# Altium project UCC28180 PFC-V02-GOWANDA.PrjPcb (part 2 of 2)

## Sheet UCC28180-2-V02 - GOWANDA.SchDoc: Title is Here
size B; Author: Taisen Zhuang; Organization: Altium Limited; Address1: L3, 12a Rodborough Rd; Address2: Frenchs Forest; Address3: NSW; Address4: Australia 2086; DocumentNumber: FMC_Microzed; Revision: B; SheetNumber: 1; SheetTotal: 3
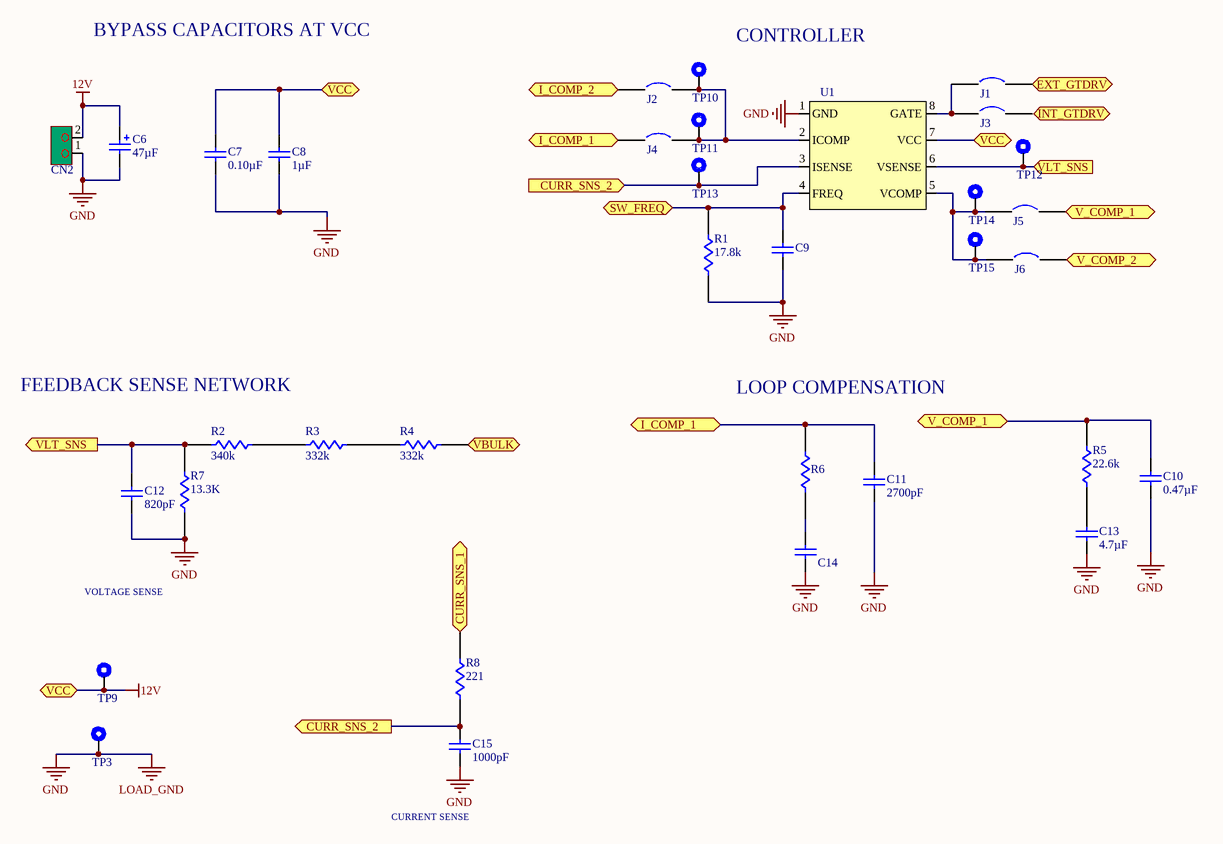
[diagram p2: UCC28180-2-V02 - GOWANDA.SchDoc]

### Parts
C6  Capacitance: 47µF  [CAPALUM47U]  (hidden comment: ECA-1VM470)
C7  Capacitance: 0.10µF  [CAP0603]  (hidden comment: 06035C104KAT2A)
C8  Capacitance: 1µF  [CAP1206]  (hidden comment: GRM32RR71H105KA01K)
C9  (no value)  [CAP0603]
C10  Capacitance: 0.47µF  [CAP0603]  (hidden comment: C0603C474K4RACTU)
C11  Capacitance: 2700pF  [CAP0603]  (hidden comment: GRM188R71H272KA01D)
C12  Capacitance: 820pF  [CAP0603]  (hidden comment: C0603C821K5RACTU)
C13  Capacitance: 4.7µF  [CAP0805]  (hidden comment: GRM21BR71A475KA73L)
C14  C0603--  [CAP0603]  (value not drawn)
C15  Capacitance: 1000pF  [CAP0603]  (hidden comment: 06031C102KAT2A)
CN2  1935776  [CONN_1935776]  (value not drawn)
J1  M20-9990246  [JUMPER]  (value not drawn)
J2  M20-9990246  [RES0603]  (value not drawn)
J3  M20-9990246  [JUMPER]  (value not drawn)
J4  M20-9990246  [RES0603]  (value not drawn)
J5  M20-9990246  [0603R]  (value not drawn)
J6  M20-9990246  [JUMPER]  (value not drawn)
R1  Resistance (Ohms): 17.8k  [RES0603]  (hidden comment: CRCW060317K8FKEA)
R2  Resistance (Ohms): 340k  [RES0805]  (hidden comment: CRCW0805340KFKEA)
R3  Resistance (Ohms): 332k  [RES0805]  (hidden comment: CRCW0805332KFKEA)
R4  Resistance (Ohms): 332k  [RES0805]  (hidden comment: CRCW0805332KFKEA)
R5  Resistance (Ohms): 22.6k  [CAP0603]  (hidden comment: CRCW060322K6FKEA)
R6  CRCW0603--  [RES0603]  (value not drawn)
R7  Resistance: 13.3K  [RES0603]  (hidden comment: CRCW060313K3FKEA)
R8  Resistance (Ohms): 221  [RES0805]  (hidden comment: CRCW0603221RFKEA)
TP3  5006  [Test Point]  (value not drawn)
TP9  5006  [Test Point]  (value not drawn)
TP10  5006  [Test Point]  (value not drawn)
TP11  5006  [Test Point]  (value not drawn)
TP12  5006  [Test Point]  (value not drawn)
TP13  5006  [Test Point]  (value not drawn)
TP14  5006  [Test Point]  (value not drawn)
TP15  5006  [Test Point]  (value not drawn)
U1  UCC28180DR  [SOP127P600X175-8N]  (value not drawn)

### Ports
CURR_SNS_1 (in), CURR_SNS_2 (in), CURR_SNS_2 (out), EXT_GTDRV (out), I_COMP_1 (bidir), I_COMP_2 (bidir), INT_GTDRV (out), SW_FREQ (bidir), V_COMP_1 (bidir), V_COMP_2 (bidir), VBULK (in), VCC (bidir), VLT_SNS (in), VLT_SNS (out)

### Nets
12V: C6.1 C7.1 C8.2 CN2.2 TP9.1 U1.7(VCC) ; port VCC
GND: C6.2 C7.2 C8.1 C9.1 C10.1 C11.1 C12.1 C13.1 C14.1 C15.1 CN2.1 R1.2 R7.2 TP3.1 U1.1(GND)  [also labelled LOAD_GND]
NetBR1_4: R8.1 ; port CURR_SNS_1
NetC9_2: C9.2 R1.1 U1.4(FREQ) ; port SW_FREQ
NetC10_2: C10.2 J5.2 R5.1 ; port V_COMP_1
NetC11_2: C11.2 J4.1 R6.1 ; port I_COMP_1
NetC12_2: C12.2 R2.2 R7.1 TP12.1 U1.6(VSENSE) ; port VLT_SNS
NetC13_2: C13.2 R5.2
NetC14_2: C14.2 R6.2
NetC15_2: C15.2 R8.2 TP13.1 U1.3(ISENSE) ; port CURR_SNS_2
NetJ1_1: J1.1 J3.1 U1.8(GATE)
NetJ1_2: J1.2 ; port EXT_GTDRV
NetJ2_1: J2.1 ; port I_COMP_2
NetJ2_2: J2.2 J4.2 TP10.1 TP11.1 U1.2(ICOMP)
NetJ5_1: J5.1 J6.1 TP14.1 TP15.1 U1.5(VCOMP)
NetJ6_2: J6.2 ; port V_COMP_2
NetR2_1: R2.1 R3.2
NetR3_1: R3.1 R4.2
NetR4_1: R4.1 ; port VBULK

Not connected (* = marked no-connect by the designer): J3 2

### Notes on the sheet
- BYPASS CAPACITORS AT VCC
- CONTROLLER
- FEEDBACK SENSE NETWORK
- LOOP COMPENSATION
- VOLTAGE SENSE
- CURRENT SENSE
- PMLS Engineers R&D
- Title:
- Size:
- Date:
- B
- Document Number:
- Sheet:
- of
- Author:
- Rev:

### Library data of the parts
C6 = ECA-1VM470: CAP ALUM 47UF 20% 35V RADIAL; Manufacturer 1: Panasonic Electronic Components; Category 1: Capacitors; Lifetime @ Temp.: 2000 Hrs @ 85°C; Polarization: Polar; Ripple Current: 130mA @ 120Hz; Supplier 1: Digi-Key; Supplier Part Number 1: P5164-ND; Manufacturer Part Number 1: ECA-1VM470; RoHS 1: RoHS Compliant; Description 1: CAP ALUM 47UF 20% 35V RADIAL; Stock 1: 32051; Pricing 1: 1=0.19, 10=0.131, 25=0.0964, 50=0.0788, 100=0.0665, 250=0.05424, 500=0.0455, 1000=0.04025, 5000=0.035 (USD); Packaging: Bulk; Part Status: Active; Tolerance: ±20%; Voltage Rating: 35V; ESR (Equivalent Series Resistance): -; Operating Temperature: -40°C ~ 85°C; Applications: General Purpose; Impedance: -; Lead Spacing: 0.079" (2.00mm); Size / Dimension: 0.197" Dia (5.00mm); Height - Seated (Max): 0.472" (12.00mm); Surface Mount Land Size: -; Mounting Type: Through Hole; Package / Case: Radial, Can; ComponentLink1URL: http://industrial.panasonic.com/www-cgi/jvcr13pz.cgi?E+PZ+3+ABA0012+ECA1VM470+7+WW; ComponentLink1Description: http://industrial.panasonic.com/www-cgi/jvcr13pz.cgi?E+PZ+3+ABA0012+ECA1VM470+7+WW
C7 = 06035C104KAT2A: CAP CER 0.1UF 50V X7R 0603; Manufacturer 1: AVX Corporation; Category 1: Capacitors; Tolerance: ±10%; Supplier 1: Digi-Key; Supplier Part Number 1: 478-5052-6-ND; Manufacturer Part Number 1: 06035C104KAT2A; RoHS 1: RoHS Compliant; Description 1: CAP CER 0.1UF 50V X7R 0603; Stock 1: 1164910; Pricing 1: 1=0.1, 10=0.037, 25=0.0268, 50=0.0202, 100=0.0165, 250=0.01376, 500=0.01176, 1000=0.00924 (USD); Packaging: Digi-Reel®; Part Status: Active; Voltage - Rated: 50V; Temperature Coefficient: X7R; Operating Temperature: -55°C ~ 125°C; Features: -; Ratings: -; Applications: General Purpose; Mounting Type: Surface Mount, MLCC; Package / Case: 0603 (1608 Metric); Size / Dimension: 0.063" L x 0.032" W (1.60mm x 0.81mm); Height - Seated (Max): -; Thickness (Max): 0.035" (0.90mm); Lead Spacing: -; Lead Style: -; ComponentLink1URL: http://datasheets.avx.com/X7RDielectric.pdf; ComponentLink1Description: http://datasheets.avx.com/X7RDielectric.pdf
C8 = GRM32RR71H105KA01K: CAP CER 1UF 50V X7R 1210; Manufacturer 1: Murata Electronics North America; Category 1: Capacitors; Tolerance: ±10%; Description 2: CAP CER 0.1UF 50V X7R 1206; Supplier 1: Digi-Key; Supplier Part Number 1: 490-11661-1-ND; Manufacturer Part Number 1: GRM32RR71H105KA01K; RoHS 1: RoHS Compliant; Description 1: CAP CER 1UF 50V X7R 1210; Stock 1: 3574; Pricing 1: 1=0.32, 10=0.28, 50=0.17, 100=0.14, 250=0.112, 500=0.102, 1000=0.092 (USD); Packaging: Cut Tape (CT); Part Status: Active; Voltage - Rated: 50V; Temperature Coefficient: X7R; Operating Temperature: -55°C ~ 125°C; Features: -; Ratings: -; Applications: General Purpose; Mounting Type: Surface Mount, MLCC; Package / Case: 1210 (3225 Metric); Size / Dimension: 0.126" L x 0.098" W (3.20mm x 2.50mm); Height - Seated (Max): -; Thickness (Max): 0.079" (2.00mm); Lead Spacing: -; Lead Style: -; ComponentLink1URL: http://www.murata.com/~/media/webrenewal/support/library/catalog/products/capacitor/mlcc/c02e.pdf; ComponentLink1Description: http://www.murata.com/~/media/webrenewal/support/library/catalog/products/capacitor/mlcc/c02e.pdf; Supplier 2: Digi-Key; Supplier Part Number 2: 478-1556-1-ND; Manufacturer 2: AVX Corporation; Manufacturer Part Number 2: 12065C104KAT2A; RoHS 2: RoHS Compliant; Category 2: Capacitors; Stock 2: 1310883; Pricing 2: 1=0.1, 10=0.073, 25=0.0528, 50=0.0412, 100=0.0341, 250=0.02824, 500=0.02392, 1000=0.0198 (USD); ComponentLink2URL: http://datasheets.avx.com/X7RDielectric.pdf; ComponentLink2Description: http://datasheets.avx.com/X7RDielectric.pdf
C9 = Cap: Capacitor; Published: 8-Jun-2000; LatestRevisionDate: 17-Jul-2002; Publisher: Altium Limited
C10 = C0603C474K4RACTU: CAP CER 0.47UF 16V X7R 0603; Manufacturer 1: KEMET; Category 1: Capacitors; Tolerance: ±10%; Supplier 1: Digi-Key; Supplier Part Number 1: 399-4922-1-ND; Manufacturer Part Number 1: C0603C474K4RACTU; RoHS 1: RoHS Compliant; Description 1: CAP CER 0.47UF 16V X7R 0603; Stock 1: 196985; Pricing 1: 1=0.15, 10=0.104, 25=0.0756, 50=0.0588, 100=0.0487, 250=0.04032, 500=0.03416, 1000=0.02828 (USD); Packaging: Cut Tape (CT); Part Status: Active; Voltage - Rated: 16V; Temperature Coefficient: X7R; Operating Temperature: -55°C ~ 125°C; Features: -; Ratings: -; Applications: General Purpose; Failure Rate: -; Mounting Type: Surface Mount, MLCC; Package / Case: 0603 (1608 Metric); Size / Dimension: 0.063" L x 0.031" W (1.60mm x 0.80mm); Height - Seated (Max): -; Thickness (Max): 0.034" (0.87mm); Lead Spacing: -; Lead Style: -; ComponentLink1URL: http://www.kemet.com/docfinder?Partnumber=C0603C474K4RACTU; ComponentLink1Description: http://www.kemet.com/docfinder?Partnumber=C0603C474K4RACTU
C11 = GRM188R71H272KA01D: CAP CER 2700PF 50V X7R 0603; Manufacturer 1: Murata Electronics North America; Category 1: Capacitors; Tolerance: ±10%; Supplier 1: Digi-Key; Supplier Part Number 1: 490-1502-6-ND; Manufacturer Part Number 1: GRM188R71H272KA01D; RoHS 1: RoHS Compliant; Description 1: CAP CER 2700PF 50V X7R 0603; Stock 1: 42465; Pricing 1: 1=0.1, 10=0.064, 25=0.0452, 50=0.0344, 100=0.0292, 250=0.02384, 500=0.0204, 1000=0.0159 (USD); Packaging: Digi-Reel®; Part Status: Active; Voltage - Rated: 50V; Temperature Coefficient: X7R; Operating Temperature: -55°C ~ 125°C; Features: -; Ratings: -; Applications: General Purpose; Mounting Type: Surface Mount, MLCC; Package / Case: 0603 (1608 Metric); Size / Dimension: 0.063" L x 0.031" W (1.60mm x 0.80mm); Height - Seated (Max): -; Thickness (Max): 0.035" (0.90mm); Lead Spacing: -; Lead Style: -; ComponentLink1URL: http://www.murata.com/~/media/webrenewal/support/library/catalog/products/capacitor/mlcc/c02e.pdf; ComponentLink1Description: http://www.murata.com/~/media/webrenewal/support/library/catalog/products/capacitor/mlcc/c02e.pdf
C12 = C0603C821K5RACTU: CAP CER 820PF 50V X7R 0603; Manufacturer 1: KEMET; Category 1: Capacitors; Tolerance: ±10%; Supplier 1: Digi-Key; Supplier Part Number 1: 399-1078-1-ND; Manufacturer Part Number 1: C0603C821K5RACTU; RoHS 1: RoHS Compliant; Description 1: CAP CER 820PF 50V X7R 0603; Stock 1: 19858; Pricing 1: 1=0.1, 10=0.052, 25=0.0376, 50=0.0282, 100=0.023, 250=0.01928, 500=0.01646, 1000=0.01293 (USD); Packaging: Cut Tape (CT); Part Status: Active; Voltage - Rated: 50V; Temperature Coefficient: X7R; Operating Temperature: -55°C ~ 125°C; Features: -; Ratings: -; Applications: General Purpose; Failure Rate: -; Mounting Type: Surface Mount, MLCC; Package / Case: 0603 (1608 Metric); Size / Dimension: 0.063" L x 0.031" W (1.60mm x 0.80mm); Height - Seated (Max): -; Thickness (Max): 0.034" (0.87mm); Lead Spacing: -; Lead Style: -; ComponentLink1URL: http://www.kemet.com/docfinder?Partnumber=C0603C821K5RACTU; ComponentLink1Description: http://www.kemet.com/docfinder?Partnumber=C0603C821K5RACTU
C13 = GRM21BR71A475KA73L: CAP CER 4.7UF 10V X7R 0805; Manufacturer 1: Murata Electronics North America; Category 1: Capacitors; Tolerance: ±10%; Supplier 1: Digi-Key; Supplier Part Number 1: 490-6480-1-ND; Manufacturer Part Number 1: GRM21BR71A475KA73L; RoHS 1: RoHS Compliant; Description 1: CAP CER 4.7UF 10V X7R 0805; Stock 1: 55696; Pricing 1: 1=0.27, 10=0.182, 50=0.11, 100=0.0924 (USD); Packaging: Cut Tape (CT); Part Status: Active; Voltage - Rated: 10V; Temperature Coefficient: X7R; Operating Temperature: -55°C ~ 125°C; Features: -; Ratings: -; Applications: General Purpose; Mounting Type: Surface Mount, MLCC; Package / Case: 0805 (2012 Metric); Size / Dimension: 0.079" L x 0.049" W (2.00mm x 1.25mm); Height - Seated (Max): -; Thickness (Max): 0.053" (1.35mm); Lead Spacing: -; Lead Style: -; ComponentLink1URL: http://www.murata.com/~/media/webrenewal/support/library/catalog/products/capacitor/mlcc/c02e.pdf; ComponentLink1Description: http://www.murata.com/~/media/webrenewal/support/library/catalog/products/capacitor/mlcc/c02e.pdf
C15 = 06031C102KAT2A: CAP CER 1000PF 100V X7R 0603; Manufacturer 1: AVX Corporation; Category 1: Capacitors; Tolerance: ±10%; Supplier 1: Digi-Key; Supplier Part Number 1: 478-1199-1-ND; Manufacturer Part Number 1: 06031C102KAT2A; RoHS 1: RoHS Compliant; Description 1: CAP CER 1000PF 100V X7R 0603; Stock 1: 182503; Pricing 1: 1=0.1, 10=0.037, 25=0.0268, 50=0.0202, 100=0.0165, 250=0.01376, 500=0.01176, 1000=0.00924 (USD); Packaging: Cut Tape (CT); Part Status: Active; Voltage - Rated: 100V; Temperature Coefficient: X7R; Operating Temperature: -55°C ~ 125°C; Features: -; Ratings: -; Applications: General Purpose; Mounting Type: Surface Mount, MLCC; Package / Case: 0603 (1608 Metric); Size / Dimension: 0.063" L x 0.032" W (1.60mm x 0.81mm); Height - Seated (Max): -; Thickness (Max): 0.035" (0.90mm); Lead Spacing: -; Lead Style: -; ComponentLink1URL: http://datasheets.avx.com/X7RDielectric.pdf; ComponentLink1Description: http://datasheets.avx.com/X7RDielectric.pdf
CN2 = 1935776: CONN TERM BLOCK 2POS 5.0MM; Manufacturer 1: Phoenix Contact; Category 1: Connectors, Interconnects; Number of Levels: 1; Positions Per Level: 2; Pitch: 0.197" (5.00mm); Mating Orientation: Horizontal with Board; Current: 20A; Voltage: 300V; Wire Gauge: 12-20 AWG; Wire Termination: Screw; Torque - Screw: 0.45-0.5 Nm (3.9-4.4 Lb-In); Screw Thread: M3; Supplier 1: Digi-Key; Supplier Part Number 1: 277-6405-ND; Manufacturer Part Number 1: 1935776; RoHS 1: RoHS Compliant; Description 1: CONN TERM BLOCK 2POS 5.0MM; Stock 1: 5591; Pricing 1: 1=0.43, 10=0.411, 50=0.3928, 100=0.382, 250=0.357, 500=0.32844, 1000=0.2975 (USD); Packaging: Bulk; Part Status: Active; Mounting Type: Through Hole; Features: Interlocking (Side); Color: Green; Operating Temperature: -; Housing Material: Polyamide (PA), Nylon; Contact Material - Plating: -; Clamp Material - Plating: -; Screw Material - Plating: -; ComponentLink1URL: http://media.digikey.com/pdf/Data%20Sheets/Phoenix%20Contact%20PDFs/COMBICON%20Compact%20PT2,5.pdf; ComponentLink1Description: http://media.digikey.com/pdf/Data%20Sheets/Phoenix%20Contact%20PDFs/COMBICON%20Compact%20PT2,5.pdf
J1-J6 = M20-9990246: SIL VERTICAL PC TAIL PIN HEADER; Manufacturer 1: Harwin Inc.; Category 1: Connectors, Interconnects; Connector Type: Header, Unshrouded, Breakaway; Number of Positions: 2; Number of Positions Loaded: All; Pitch: 0.100" (2.54mm); Supplier 1: Digi-Key; Supplier Part Number 1: 952-2262-ND; Manufacturer Part Number 1: M20-9990246; RoHS 1: RoHS Compliant; Description 1: SIL VERTICAL PC TAIL PIN HEADER; Stock 1: 66533; Pricing 1: 1=0.11, 10=0.099, 100=0.0609, 500=0.0504, 1000=0.0441, 5000=0.0378, 10000=0.03675 (USD); Packaging: Bulk; Part Status: Active; Contact Type: Male Pin; Number of Rows: 1; Row Spacing: -; Contact Mating Length: 0.240" (6.10mm); Mounting Type: Through Hole; Termination: Solder; Fastening Type: -; Features: -; Contact Finish: Tin; Contact Finish Thickness: -; Color: Black; ComponentLink1URL: https://cdn.harwin.com/pdfs/M20-999.pdf; ComponentLink1Description: https://cdn.harwin.com/pdfs/M20-999.pdf
R1 = CRCW060317K8FKEA: RES SMD 17.8K OHM 1% 1/10W 0603; Manufacturer 1: Vishay Dale; Category 1: Resistors; Power (Watts): 0.1W, 1/10W; Temperature Coefficient: ±100ppm/°C; Supplier 1: Digi-Key; Supplier Part Number 1: 541-17.8KHCT-ND; Manufacturer Part Number 1: CRCW060317K8FKEA; RoHS 1: RoHS Compliant; Description 1: RES SMD 17.8K OHM 1% 1/10W 0603; Stock 1: 18072; Pricing 1: 1=0.1, 10=0.03, 25=0.022, 50=0.0168, 100=0.0123, 250=0.0094, 500=0.00752, 1000=0.00554 (USD); Packaging: Cut Tape (CT); Part Status: Active; Tolerance: ±1%; Composition: Thick Film; Features: Automotive AEC-Q200; Operating Temperature: -55°C ~ 155°C; Package / Case: 0603 (1608 Metric); Supplier Device Package: 0603; Size / Dimension: 0.063" L x 0.033" W (1.60mm x 0.85mm); Height - Seated (Max): 0.020" (0.50mm); Number of Terminations: 2; Failure Rate: -; ComponentLink1URL: http://www.vishay.com/docs/20035/dcrcwe3.pdf; ComponentLink1Description: http://www.vishay.com/docs/20035/dcrcwe3.pdf
R2 = CRCW0805340KFKEA: RES SMD 340K OHM 1% 1/8W 0805; Manufacturer 1: Vishay Dale; Category 1: Resistors; Power (Watts): 0.125W, 1/8W; Temperature Coefficient: ±100ppm/°C; Supplier 1: Digi-Key; Supplier Part Number 1: 541-340KCCT-ND; Manufacturer Part Number 1: CRCW0805340KFKEA; RoHS 1: RoHS Compliant; Description 1: RES SMD 340K OHM 1% 1/8W 0805; Stock 1: 2950; Pricing 1: 1=0.1, 10=0.04, 25=0.0288, 50=0.022, 100=0.0162, 250=0.01236, 500=0.0099, 1000=0.00729 (USD); Packaging: Cut Tape (CT); Part Status: Active; Tolerance: ±1%; Composition: Thick Film; Features: Automotive AEC-Q200; Operating Temperature: -55°C ~ 155°C; Package / Case: 0805 (2012 Metric); Supplier Device Package: 0805; Size / Dimension: 0.079" L x 0.049" W (2.00mm x 1.25mm); Height - Seated (Max): 0.020" (0.50mm); Number of Terminations: 2; Failure Rate: -; ComponentLink1URL: http://www.vishay.com/docs/20035/dcrcwe3.pdf; ComponentLink1Description: http://www.vishay.com/docs/20035/dcrcwe3.pdf
R3 R4 = CRCW0805332KFKEA: RES SMD 332K OHM 1% 1/8W 0805; Manufacturer 1: Vishay Dale; Category 1: Resistors; Power (Watts): 0.125W, 1/8W; Temperature Coefficient: ±100ppm/°C; Supplier 1: Digi-Key; Supplier Part Number 1: 541-332KCCT-ND; Manufacturer Part Number 1: CRCW0805332KFKEA; RoHS 1: RoHS Compliant; Description 1: RES SMD 332K OHM 1% 1/8W 0805; Stock 1: 14758; Pricing 1: 1=0.1, 10=0.04, 25=0.0288, 50=0.022, 100=0.0162, 250=0.01236, 500=0.0099, 1000=0.00729 (USD); Packaging: Cut Tape (CT); Part Status: Active; Tolerance: ±1%; Composition: Thick Film; Features: Automotive AEC-Q200; Operating Temperature: -55°C ~ 155°C; Package / Case: 0805 (2012 Metric); Supplier Device Package: 0805; Size / Dimension: 0.079" L x 0.049" W (2.00mm x 1.25mm); Height - Seated (Max): 0.020" (0.50mm); Number of Terminations: 2; Failure Rate: -; ComponentLink1URL: http://www.vishay.com/docs/20035/dcrcwe3.pdf; ComponentLink1Description: http://www.vishay.com/docs/20035/dcrcwe3.pdf
R5 = CRCW060322K6FKEA: RES SMD 22.6K OHM 1% 1/10W 0603; Manufacturer 1: Vishay Dale; Category 1: Resistors; Power (Watts): 0.1W, 1/10W; Temperature Coefficient: ±100ppm/°C; Supplier 1: Digi-Key; Supplier Part Number 1: 541-22.6KHCT-ND; Manufacturer Part Number 1: CRCW060322K6FKEA; RoHS 1: RoHS Compliant; Description 1: RES SMD 22.6K OHM 1% 1/10W 0603; Stock 1: 27075; Pricing 1: 1=0.1, 10=0.03, 25=0.022, 50=0.0168, 100=0.0123, 250=0.0094, 500=0.00752, 1000=0.00554 (USD); Packaging: Cut Tape (CT); Part Status: Active; Tolerance: ±1%; Composition: Thick Film; Features: Automotive AEC-Q200; Operating Temperature: -55°C ~ 155°C; Package / Case: 0603 (1608 Metric); Supplier Device Package: 0603; Size / Dimension: 0.063" L x 0.033" W (1.60mm x 0.85mm); Height - Seated (Max): 0.020" (0.50mm); Number of Terminations: 2; Failure Rate: -; ComponentLink1URL: http://www.vishay.com/docs/20035/dcrcwe3.pdf; ComponentLink1Description: http://www.vishay.com/docs/20035/dcrcwe3.pdf
R7 = CRCW060313K3FKEA: RES SMD 13.3K OHM 1% 1/10W 0603; Manufacturer 1: Vishay Dale; Category 1: Resistors; Power (Watts): 0.1W, 1/10W; Temperature Coefficient: ±100ppm/°C; Supplier 1: Digi-Key; Supplier Part Number 1: 541-13.3KHCT-ND; Manufacturer Part Number 1: CRCW060313K3FKEA; RoHS 1: RoHS Compliant; Description 1: RES SMD 13.3K OHM 1% 1/10W 0603; Stock 1: 50587; Pricing 1: 1=0.1, 10=0.03, 25=0.022, 50=0.0168, 100=0.0123, 250=0.0094, 500=0.00752, 1000=0.00554 (USD); Packaging: Cut Tape (CT); Part Status: Active; Tolerance: ±1%; Composition: Thick Film; Features: Automotive AEC-Q200; Operating Temperature: -55°C ~ 155°C; Package / Case: 0603 (1608 Metric); Supplier Device Package: 0603; Size / Dimension: 0.063" L x 0.033" W (1.60mm x 0.85mm); Height - Seated (Max): 0.020" (0.50mm); Number of Terminations: 2; Failure Rate: -; ComponentLink1URL: http://www.vishay.com/docs/20035/dcrcwe3.pdf; ComponentLink1Description: http://www.vishay.com/docs/20035/dcrcwe3.pdf
R8 = CRCW0603221RFKEA: RES SMD 221 OHM 1% 1/10W 0603; Manufacturer 1: Vishay Dale; Category 1: Resistors; Power (Watts): 0.1W, 1/10W; Temperature Coefficient: ±100ppm/°C; Supplier 1: Digi-Key; Supplier Part Number 1: 541-221HCT-ND; Manufacturer Part Number 1: CRCW0603221RFKEA; RoHS 1: RoHS Compliant; Description 1: RES SMD 221 OHM 1% 1/10W 0603; Stock 1: 23466; Pricing 1: 1=0.1, 10=0.03, 25=0.022, 50=0.0168, 100=0.0123, 250=0.0094, 500=0.00752, 1000=0.00554 (USD); Packaging: Cut Tape (CT); Part Status: Active; Tolerance: ±1%; Composition: Thick Film; Features: Automotive AEC-Q200; Operating Temperature: -55°C ~ 155°C; Package / Case: 0603 (1608 Metric); Supplier Device Package: 0603; Size / Dimension: 0.063" L x 0.033" W (1.60mm x 0.85mm); Height - Seated (Max): 0.020" (0.50mm); Number of Terminations: 2; Failure Rate: -; ComponentLink1URL: http://www.vishay.com/docs/20035/dcrcwe3.pdf; ComponentLink1Description: http://www.vishay.com/docs/20035/dcrcwe3.pdf
TP3 TP9-TP15 = 5006: TEST POINT PC COMPACT .063"D BLK; Manufacturer 1: Keystone Electronics; Category 1: Test and Measurement; Plating: Silver; Material - Insulation: Nylon 46, UL 94V-0; Material - Body: Phosphor Bronze; Supplier 1: Digi-Key; Supplier Part Number 1: 36-5006-ND; Manufacturer Part Number 1: 5006; RoHS 1: RoHS Compliant; Description 1: TEST POINT PC COMPACT .063"D BLK; Stock 1: 199444; Pricing 1: 1=0.37, 10=0.316, 50=0.2298, 100=0.2209, 250=0.19832, 500=0.18932, 1000=0.1616, 2500=0.14424, 5000=0.13523 (USD); Packaging: Bulk; Part Status: Active; Type: PC Test Point, Compact; Mounting Type: 0.063" (1.60mm) Hole Diameter; Color: Black; Size / Dimension: 0.125" Dia x 0.220" L (3.18mm x 5.59mm); ComponentLink1URL: http://www.keyelco.com/product-pdf.cfm?p=1314; ComponentLink1Description: http://www.keyelco.com/product-pdf.cfm?p=1314
U1 = UCC28180DR: IC PFC CTRLR AVERAGE CURR 8SOIC; Manufacturer 1: Texas Instruments; Category 1: Integrated Circuits (ICs); Mode: Continuous Conduction (CCM); Frequency - Switching: 18kHz ~ 250kHz; Current - Startup: 75µA; Voltage - Supply: 21V; Supplier 1: Digi-Key; Supplier Part Number 1: 296-44502-2-ND; Manufacturer Part Number 1: UCC28180DR; RoHS 1: RoHS Compliant; Description 1: IC PFC CTRLR AVERAGE CURR 8SOIC; Stock 1: 5000; Pricing 1: 2500=0.50625 (USD); Packaging: Tape & Reel (TR); Part Status: Active; Operating Temperature: -40°C ~ 125°C; Mounting Type: Surface Mount; Package / Case: 8-SOIC (0.154", 3.90mm Width); Supplier Device Package: 8-SOIC; ComponentLink1URL: http://www.ti.com/lit/ds/symlink/ucc28180.pdf; ComponentLink1Description: http://www.ti.com/lit/ds/symlink/ucc28180.pdf

## Nets that join several sheets
12V: UCC28180-3-V02-GOWANDA (U2.1), UCC28180-2-V02 - GOWANDA (6 pins)
GND: UCC28180-3-V02-GOWANDA (15 pins), UCC28180-2-V02 - GOWANDA (15 pins)
NetBR1_1: UCC28180-3-V02-GOWANDA (D5.1 L2.1), UCC 28180-1-V02 -GOWANDA (BR1.1 C3.2 TP1.1)
NetBR1_4: UCC28180-3-V02-GOWANDA (R15.2), UCC 28180-1-V02 -GOWANDA (BR1.4 C3.1 TP2.1), UCC28180-2-V02 - GOWANDA (R8.1)
NetJ1_2: UCC28180-3-V02-GOWANDA (U2.6), UCC28180-2-V02 - GOWANDA (J1.2)
NetR4_1: UCC28180-3-V02-GOWANDA (R16.2 TP20.1), UCC28180-2-V02 - GOWANDA (R4.1)